# EAGLE schematic RDA5807M_BREAKOUT_SETUP (EAGLE 9.6.2)
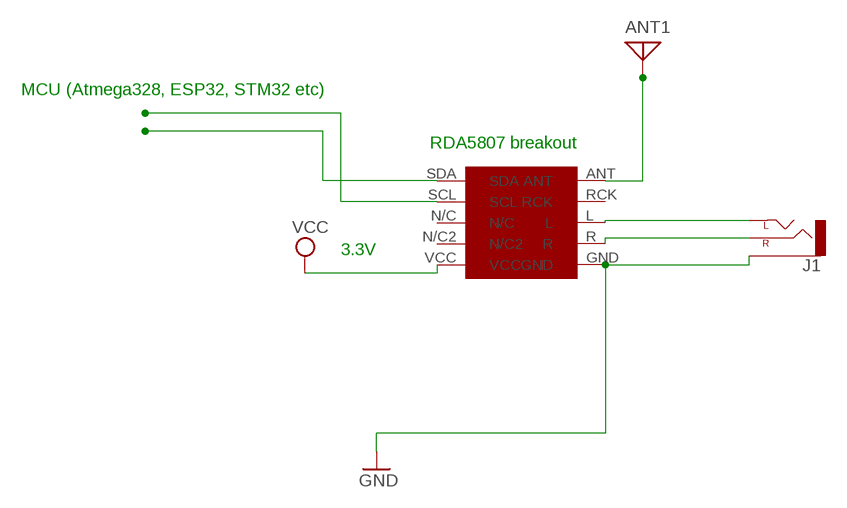
[diagram p0: schematic, sheet 1]

## Parts
ANT1  ANTENNA  [PAD-01]
J1  AUDIO_JACK_2.5MMSPECIAL_POGO_PINS  [STEREOJACK2.5MM_SPECIAL_POGOPINS]
U$1  RDA  [RDA]

## Nets
GND: J1.RING1(SLEEVE) U$1.GND
N$1: U$1.SDA
N$2: U$1.SCL
N$3: J1.SHIELD(LEFT) U$1.L
N$5: J1.TIP(RIGHT) U$1.R
N$6: ANT1.1 U$1.ANT
VCC: U$1.VCC
Unconnected: U$1.N/C U$1.N/C2 U$1.RCK

## Notes on the sheet
- MCU (Atmega328, ESP32, STM32 etc)
- RDA5807 breakout
- 3.3V

## Library data of the parts
ANT1 = discrete:ANTENNA: Antenna
J1 = SparkFun-Connectors:AUDIO_JACK_2.5MM: Audio Jack 2.5mm variants of PTH and SMT audio jacks. SparkFun Products: SparkFun PicoBoard <https://www.sparkfun.com/products/11888>- 2.5mm SMD
U$1 = RDA:RDA